# EAGLE design famicom1 (EAGLE 7.7.0)
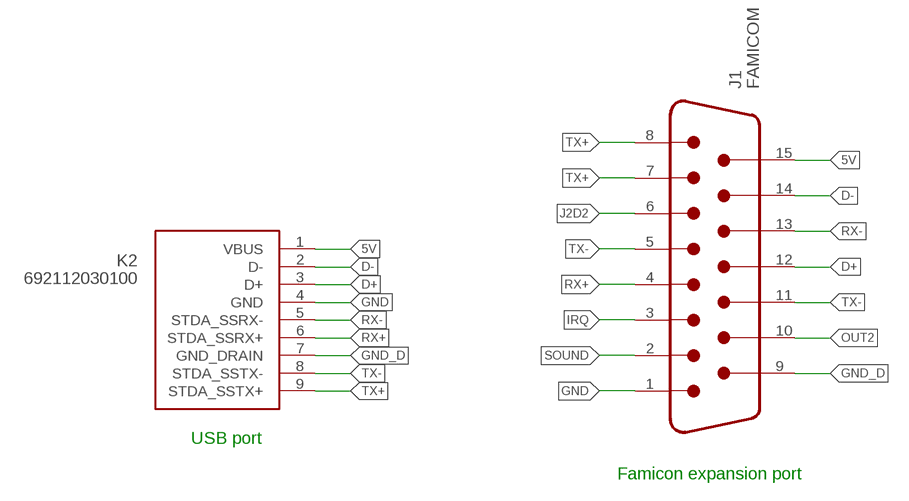
[diagram p0: schematic, sheet 1]

## Parts
J1  FAMICOM  [FAMICOM]
K2  692112030100  [692112030100]

## Nets
5V: J1.15 K2.1(VBUS)
D+: J1.12 K2.3(D+)
D-: J1.14 K2.2(D-)
GND: J1.1 K2.4(GND)
GND_D: J1.9 K2.7(GND_DRAIN)
IRQ: J1.3
J2D2: J1.6
OUT2: J1.10
RX+: J1.4 K2.6(STDA_SSRX+)
RX-: J1.13 K2.5(STDA_SSRX-)
SOUND: J1.2
TX+: J1.7 J1.8 K2.9(STDA_SSTX+)
TX-: J1.5 J1.11 K2.8(STDA_SSTX-)

## Notes on the sheet
- USB port
- Famicon expansion port

## Library data of the parts
J1 = famicom:FAMICOM: Famicom PCB Connector, 15 Pins=>Code : Famicom <http> Details see: http Created 2014-07-10, K 2014 Check availability <https>; AVAILABILITY: In Stock; MF: k; MP: Famicom; PACKAGE: None; PRICE: None; PURCHASE-URL: https
K2 = Wuerth_Elektronik_eiCan_Communication_Connectors_STENCIL:692112030100: WR-COM USB 3.0 SMT PLUG WITH CLIPTYPE A

## Board
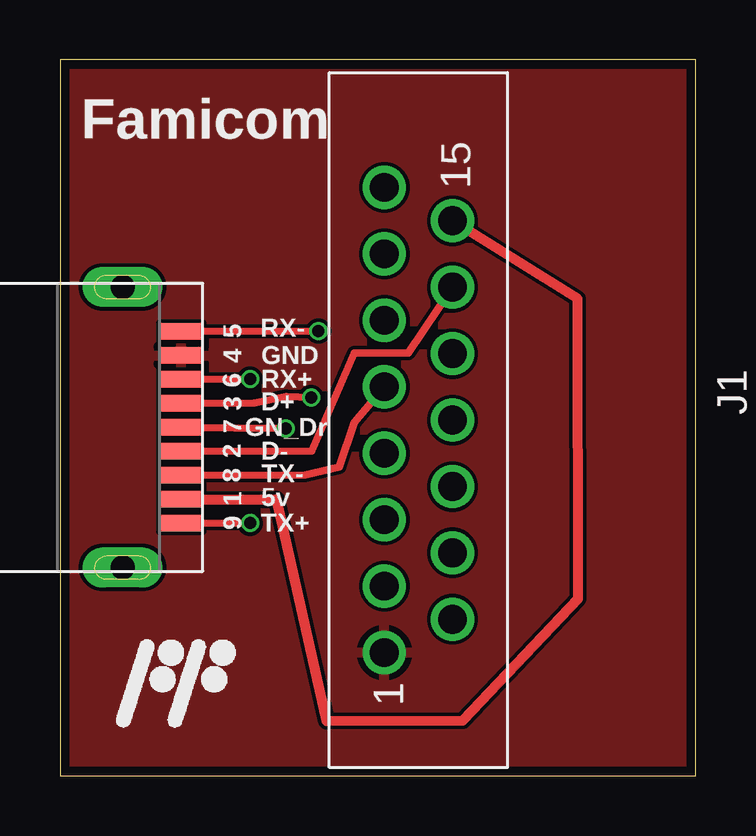
[diagram p1: board, top side]
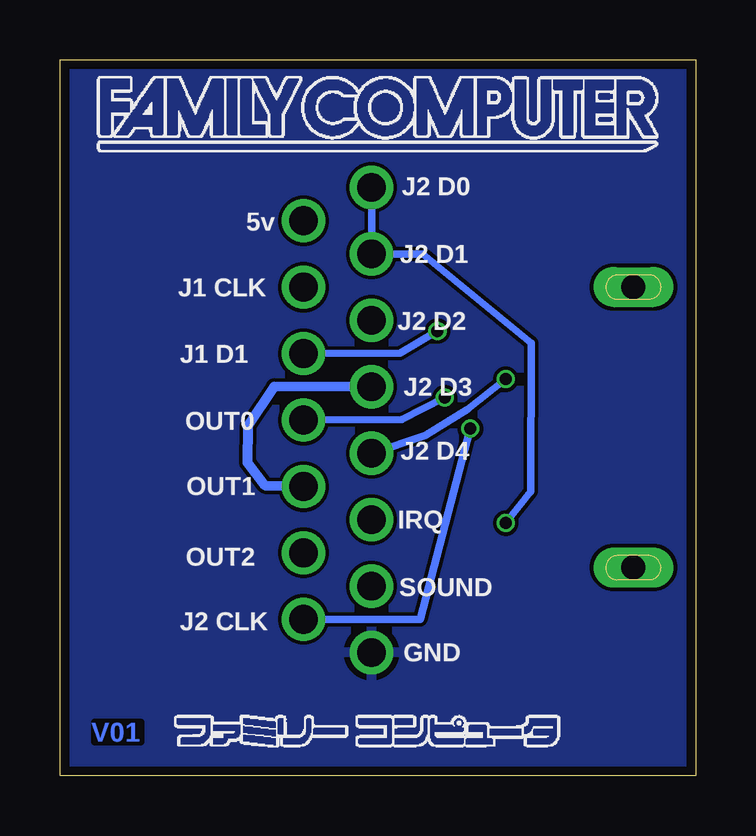
[diagram p2: board, bottom side, seen from below]

Size 26.5 x 29.85 mm. Coordinates in mm from the lower left corner, seen from the top.
Outline: 0,0 26.5,0 26.5,29.85 0,29.85 0,0
Copper layers (1*16): Top 0.035559375mm / dielectric 1.6mm / Bottom 0.035559375mm
Design rules "oshpark-2layer": minimum track width 6mil, minimum drill 10mil, track to track 6mil, track to pad 6mil, pad to pad 6mil, via to via 6mil, smd to smd 6mil, copper to edge 15mil, drill to drill 6mil, minimum pad ring 5mil, minimum via ring 5mil, stop-mask expansion 2.5mil, vias tented up to drill 0mil, thermal gap 10mil

### Footprints (pad centres in the part's own frame; a part is rotated, then mirrored left to right if it is on the bottom)
FAMICOM = drill 1.2: 1 -9.695,1.42; 2 -6.925,1.42; 3 -4.155,1.42; 4 -1.385,1.42; 5 1.385,1.42; 6 4.155,1.42; 7 6.925,1.42; 8 9.695,1.42; 9 -8.31,-1.42; 10 -5.54,-1.42; 11 -2.77,-1.42; 12 0,-1.42; 13 2.77,-1.42; 14 5.54,-1.42; 15 8.31,-1.42
692112030100 = smd 0.7 x 1.8: 1 -3,0; 2 -1,0; 3 1,0; 4 3,0; 5 4,0; 6 2,0; 7 0,0; 8 -2,0; 9 -4,0 | drill 1 pad 1.676 long: Z1 5.85,2.45; Z2 -5.85,2.45

### Placement (x,y rotation side)
J1  14.94,14.83 90 top
K2  5.05,14.53 90 top

### Tracks (layer width: path | path; a pad name or v marks a point on that pad's centre or on a via)
5V
  Top 0.406: K2.1 9.02,11.53 11.1,2.29 16.79,2.31 21.59,7.39 21.56,19.89 J1.15
D+  (via drill 0.5)
  Top 0.305: K2.3 8.1,15.54 9.42,15.82 v10.47,15.77
  Bottom 0.305: v10.47,15.77 12.27,14.86 J1.12
D-
  Top 0.305: K2.2 10.49,13.54 12.27,17.63 14.5,17.63 J1.14
GND
  pour Bottom: 0.41,29.9 26.39,29.69 26.47,0.15 0.1,-0.03
  pour Top: 0.3,29.9 26.57,29.74 26.42,0.18 0.05,0
GND_D  (via drill 0.5)
  Top 0.305: K2.7 v9.4,14.48
  Bottom 0.305: v9.4,14.48 11.48,6.53 J1.9
RX+  (via drill 0.5)
  Top 0.305: K2.6 v7.93,16.54
  Bottom 0.305: v7.93,16.54 9.53,15.27 11.28,14.2 J1.4
RX-  (via drill 0.5)
  Top 0.305: K2.5 v10.77,18.54
  Bottom 0.305: v10.77,18.54 12.32,17.63 J1.13
TX+  (via drill 0.5)
  Top 0.305: K2.9 v7.93,10.54
  Bottom 0.305: v7.93,10.54 6.88,11.86 6.86,18.03 11.38,21.74 J1.7 J1.8
TX-
  Top 0.305: K2.8 10.21,12.55 11.63,12.88 12.27,14.73 J1.5
  Bottom 0.406: J1.5 17.58,16.23 18.67,14.58 18.69,13.06 17.96,12.12 J1.11

### Text on the board
Bottom: V01
tPlace: Famicom | 5 | RX- | 4 | GND | 6 | RX+ | 3 | D+ | 7 | GN_Dr | 2 | D- | 8 | TX- | 1 | 5v | 9 | TX+
bPlace: J2 D0 | 5v | J2 D1 | J1 CLK | J2 D2 | J1 D1 | J2 D3 | OUT0 | J2 D4 | OUT1 | IRQ | OUT2 | SOUND | J2 CLK | GND